# EAGLE schematic Destama RN (21507334088) Measure Temp Arduino (EAGLE 9.6.2)
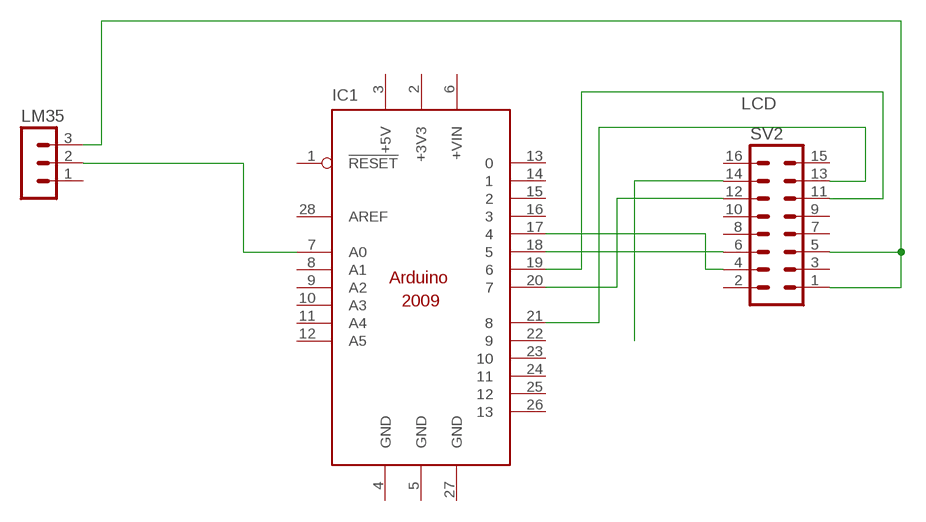
[diagram p0: schematic, sheet 1]

## Parts
IC1  ARDUINO2009_12  [ARDUINO2009_2]
LM35  MA03-1  [MA03-1]
SV2  MA08-2  [MA08-2]

## Nets
LCD: IC1.21 SV2.13
N$1: LM35.3 SV2.1 SV2.5
N$2: IC1.17 SV2.4
N$3: IC1.18 SV2.6
N$4: IC1.19 SV2.11
N$5: IC1.20 SV2.12
N$7: SV2.14
N$8: IC1.7(A0) LM35.2
Unconnected: IC1.1(!RESET) IC1.6(+VIN) IC1.8(A1) IC1.9(A2) IC1.10(A3) IC1.11(A4) IC1.12(A5) IC1.13 IC1.14 IC1.15 IC1.16 IC1.22 IC1.23 IC1.24 IC1.25 IC1.26 IC1.28(AREF) LM35.1 SV2.2 SV2.3 SV2.7 SV2.8 SV2.9 SV2.10 SV2.15 SV2.16

## Power pins joined to a net without a drawn wire
+3V3: IC1.2(+3V3)
+5V: IC1.3(+5V)
GND: IC1.4(GND) IC1.5(GND) IC1.27(GND)

## Library data of the parts
IC1 = arduino:ARDUINO2009_1: The Arduino Duemilanove ("2009") is a microcontroller board based on the ATmega168 or ATmega328. - 14 digital input/output pins (of which 6 can be used as PWM outputs) - 6 analog inputs, a 16 MHz crystal oscillator - USB connection - power jack - ISP header - reset button It contains everything needed to support the microcontroller; simply connect it to a computer with a USB cable or power it with a AC-to-DC adapter or battery to get started http://arduino.cc/en/Main/ArduinoBoardDuemilanove
LM35 = con-lstb:MA03-1: PIN HEADER; OC_FARNELL: unknown; OC_NEWARK: unknown
SV2 = con-lstb:MA08-2: PIN HEADER; OC_FARNELL: unknown; OC_NEWARK: unknown